# Altium schematic sheet 8_Port.SchDoc
size A4
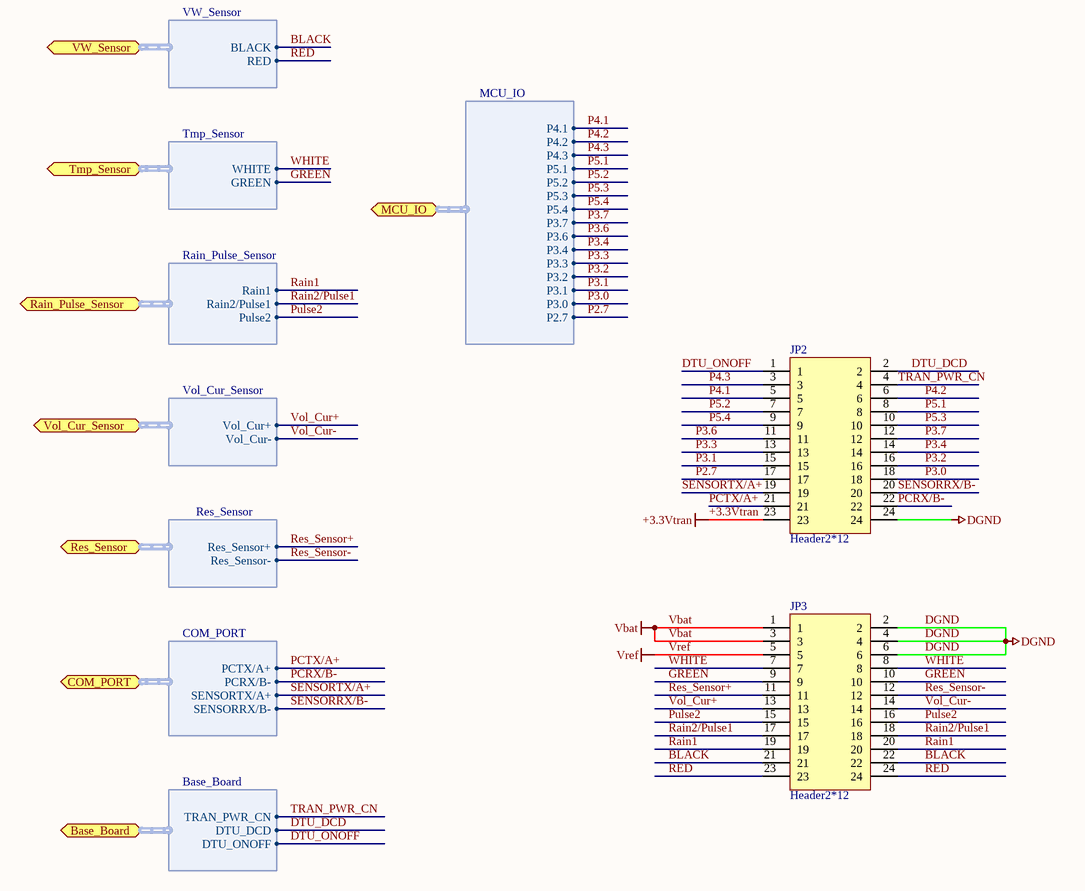
[diagram p0: 8_Port.SchDoc]

## Parts
JP2  Header2*12  [IDC24-2.0MM-INSERT]
JP3  Header2*12  [IDC24-2.0MM-INSERT]

## Ports
Base_Board (harness Base_Board), COM_PORT (harness COM_PORT), MCU_IO (harness MCU_IO), Rain_Pulse_Sensor (harness Rain_Pulse_Sensor), Res_Sensor (harness Res_Sensor), Tmp_Sensor (harness Tmp_Sensor), Vol_Cur_Sensor (harness Vol_Cur_Sensor), VW_Sensor (harness VW_Sensor)

## Harnesses
Rain_Pulse_Sensor: Rain1, Rain2/Pulse1, Pulse2
VW_Sensor: RED, BLACK
Vol_Cur_Sensor: Vol_Cur+, Vol_Cur-
Tmp_Sensor: GREEN, WHITE
Res_Sensor: Res_Sensor+, Res_Sensor-
COM_PORT: PCTX/A+, PCRX/B-, SENSORRX/B-, SENSORTX/A+
Base_Board: TRAN_PWR_CN, DTU_DCD, DTU_ONOFF
MCU_IO: P4.1, P4.2, P4.3, P5.1, P5.2, P5.3, P5.4, P3.0, P3.1, P3.2, P3.3, P3.4, P2.7, P3.6, P3.7

## Nets
+3.3Vtran: JP2.23
DGND: JP2.24 JP3.2 JP3.4 JP3.6
Vbat: JP3.1 JP3.3
Vref: JP3.5
BLACK: JP3.21 JP3.22 ; port VW_Sensor.BLACK
DTU_DCD: JP2.2 ; port Base_Board.DTU_DCD
DTU_ONOFF: JP2.1 ; port Base_Board.DTU_ONOFF
GREEN: JP3.9 JP3.10 ; port Tmp_Sensor.GREEN
P2.7: JP2.17 ; port MCU_IO.P2.7
P3.0: JP2.18 ; port MCU_IO.P3.0
P3.1: JP2.15 ; port MCU_IO.P3.1
P3.2: JP2.16 ; port MCU_IO.P3.2
P3.3: JP2.13 ; port MCU_IO.P3.3
P3.4: JP2.14 ; port MCU_IO.P3.4
P3.6: JP2.11 ; port MCU_IO.P3.6
P3.7: JP2.12 ; port MCU_IO.P3.7
P4.1: JP2.5 ; port MCU_IO.P4.1
P4.2: JP2.6 ; port MCU_IO.P4.2
P4.3: JP2.3 ; port MCU_IO.P4.3
P5.1: JP2.8 ; port MCU_IO.P5.1
P5.2: JP2.7 ; port MCU_IO.P5.2
P5.3: JP2.10 ; port MCU_IO.P5.3
P5.4: JP2.9 ; port MCU_IO.P5.4
PCRX/B-: JP2.22 ; port COM_PORT.PCRX/B-
PCTX/A+: JP2.21 ; port COM_PORT.PCTX/A+
Pulse2: JP3.15 JP3.16 ; port Rain_Pulse_Sensor.Pulse2
Rain1: JP3.19 JP3.20 ; port Rain_Pulse_Sensor.Rain1
Rain2/Pulse1: JP3.17 JP3.18 ; port Rain_Pulse_Sensor.Rain2/Pulse1
RED: JP3.23 JP3.24 ; port VW_Sensor.RED
Res_Sensor+: JP3.11 ; port Res_Sensor.Res_Sensor+
Res_Sensor-: JP3.12 ; port Res_Sensor.Res_Sensor-
SENSORRX/B-: JP2.20 ; port COM_PORT.SENSORRX/B-
SENSORTX/A+: JP2.19 ; port COM_PORT.SENSORTX/A+
TRAN_PWR_CN: JP2.4 ; port Base_Board.TRAN_PWR_CN
Vol_Cur+: JP3.13 ; port Vol_Cur_Sensor.Vol_Cur+
Vol_Cur-: JP3.14 ; port Vol_Cur_Sensor.Vol_Cur-
WHITE: JP3.7 JP3.8 ; port Tmp_Sensor.WHITE